# Altium schematic sheet lcd_16_2.SchDoc
size A4; Engineer: Amir Hossein Jobeiri; Organization: Simaran; SheetNumber: 6; SheetTotal: 23
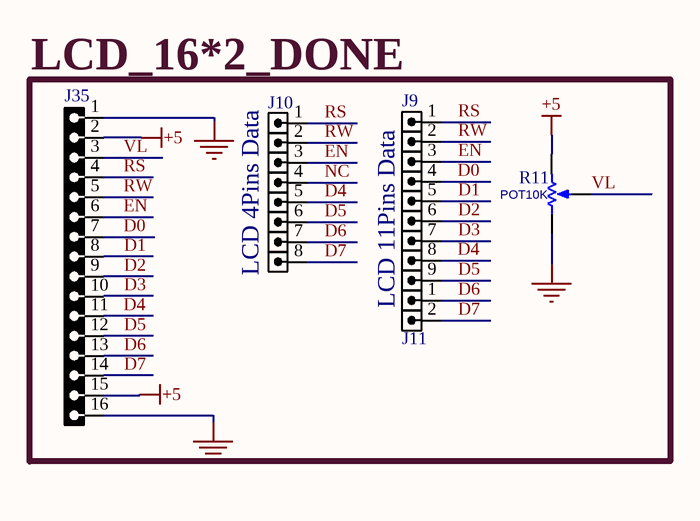
[diagram p0: lcd_16_2.SchDoc]

## Parts
J9  HDR1X9  [HDR_M_1X9]  (value not drawn)
J10  HDR1X8  [HDR_M_1X8]  (value not drawn)
J11  HDRM2  [HDR_M_1X2]  (value not drawn)
J35  HDRF16  [HDR_F_1X16]  (value not drawn)
R11  POT10K  [POT_7X5]

## Nets
+5: J35.2 J35.15 R11.3(BOT)
GND: J35.1 J35.16 R11.1(TOP)
D0: J9.4 J35.7
D1: J9.5 J35.8
D2: J9.6 J35.9
D3: J9.7 J35.10
D4: J9.8 J10.5 J35.11
D5: J9.9 J10.6 J35.12
D6: J10.7 J11.1 J35.13
D7: J10.8 J11.2 J35.14
EN: J9.3 J10.3 J35.6
NC: J10.4
RS: J9.1 J10.1 J35.4
RW: J9.2 J10.2 J35.5
VL: J35.3 R11.2(TAP)

## Notes on the sheet
- LCD_16*2_DONE
- (near J10) LCD 4Pins Data
- LCD 11Pins Data

## Library data of the parts
J9 = HDR_M_1X9: CONN, HEADER, Male, pitch: 2.54mm, 9POS; VALUE: HDRM9
J10 = HDR_M_1X8: CONN, HEADER, Male, pitch: 2.54mm, 8POS; VALUE: HDRM8
J11 = HDR_M_1X2: CONN, HEADER, Male, pitch: 2.54mm, 2POS; VALUE: HDRM2
J35 = HDR_F_1X16: CONN, HEADER, Female, pitch: 2.54mm, 16POS; VALUE: HDRF16
R11 = RES_THD_POT_7X5: RESISTOR, THD, Potentiometer; VALUE: POT10K